# Altium schematic sheet interface.SchDoc
size A4
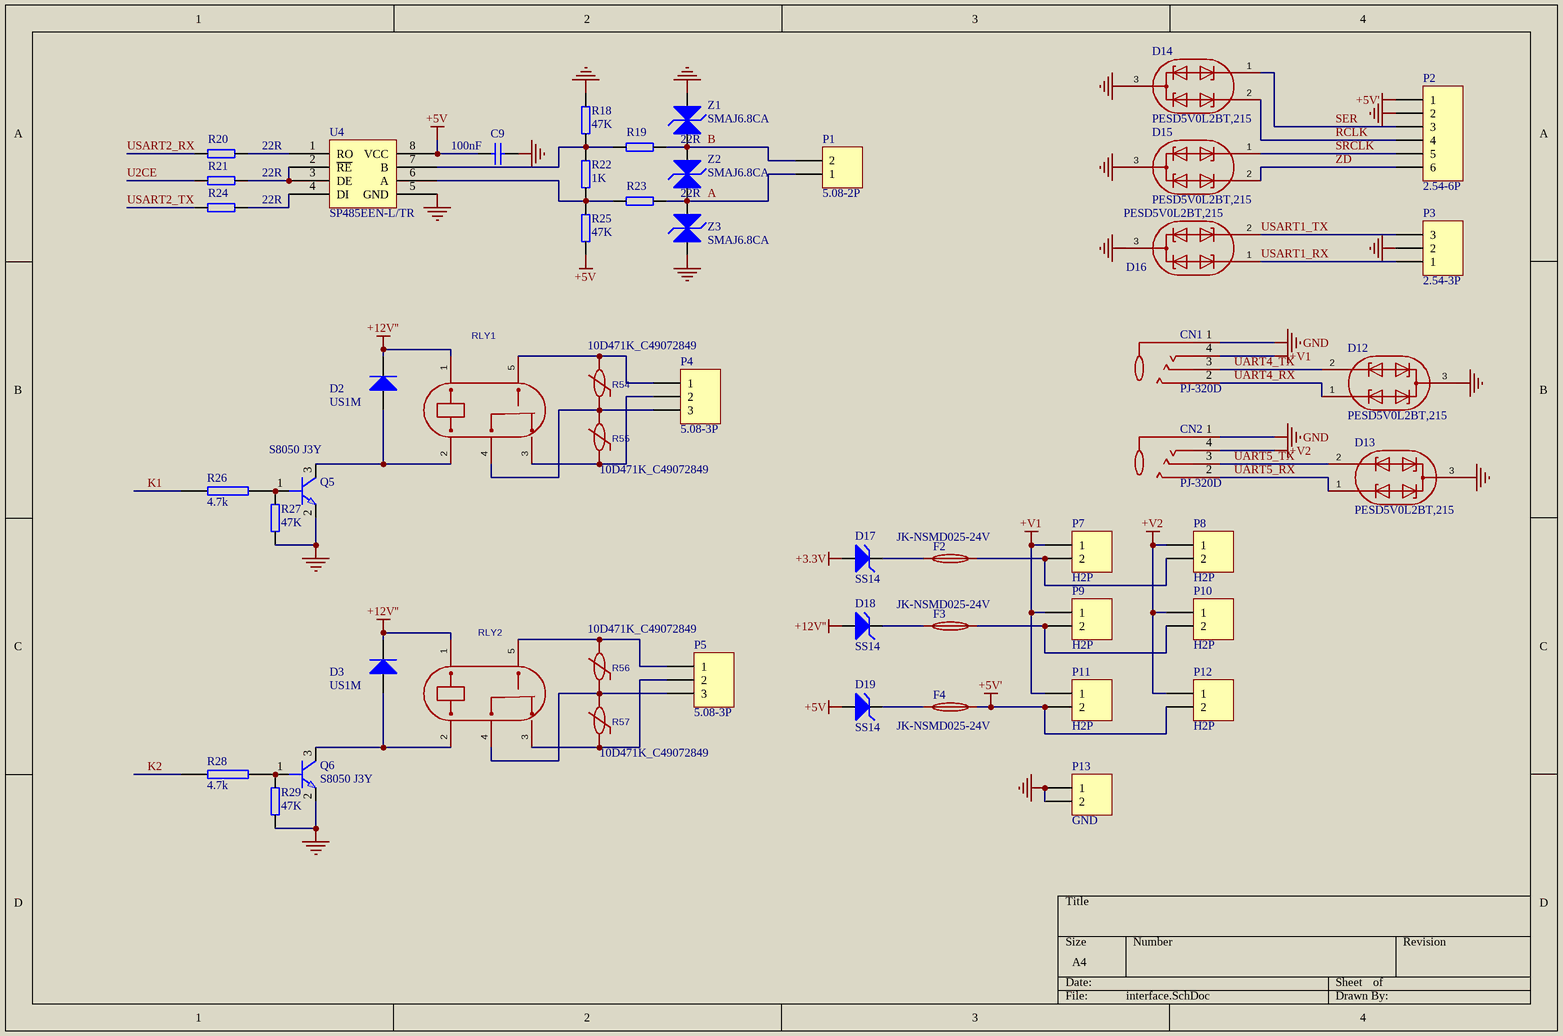
[diagram p0: interface.SchDoc]

## Parts
C9  100nF  [LC-0805_C]
CN1  PJ-320D  [4PIN]
CN2  PJ-320D  [4PIN]
D2  US1M  [LC-SMA(DO-214AC)_S2]
D3  US1M  [LC-SMA(DO-214AC)_S2]
D12  PESD5V0L2BT,215  [SOT-23]
D13  PESD5V0L2BT,215  [SOT-23]
D14  PESD5V0L2BT,215  [SOT-23]
D15  PESD5V0L2BT,215  [SOT-23]
D16  PESD5V0L2BT,215  [SOT-23]
D17  SS14  [LC-SMA(DO-214AC)_S5]
D18  SS14  [LC-SMA(DO-214AC)_S5]
D19  SS14  [LC-SMA(DO-214AC)_S5]
F2  JK-NSMD025-24V  [LC-1206_R]
F3  JK-NSMD025-24V  [LC-1206_R]
F4  JK-NSMD025-24V  [LC-1206_R]
P1  5.08-2P  [MKDSN_2RMI]
P2  2.54-6P  [6PIN]
P3  2.54-3P  [3PIN]
P4  5.08-3P  [5.08-3P]
P5  5.08-3P  [5.08-3P]
P7  H2P  [HDR1X2]
P8  H2P  [HDR1X2]
P9  H2P  [HDR1X2]
P10  H2P  [HDR1X2]
P11  H2P  [HDR1X2]
P12  H2P  [HDR1X2]
P13  GND  [HDR1X2]
Q5  S8050 J3Y  [SOT-23]
Q6  S8050 J3Y  [SOT-23]
R18  47K  [LC-0805_R]
R19  22R  [LC-0805_R]
R20  22R  [LC-0805_R]
R21  22R  [LC-0805_R]
R22  1K  [LC-0805_R]
R23  22R  [LC-0805_R]
R24  22R  [LC-0805_R]
R25  47K  [LC-0805_R]
R26  4.7k  [LC-0805_R]
R27  47K  [LC-0805_R]
R28  4.7k  [LC-0805_R]
R29  47K  [LC-0805_R]
R54  10D471K_C49072849  [RES-TH_L11.0-W6.0-P7.50]
R55  10D471K_C49072849  [RES-TH_L11.0-W6.0-P7.50]
R56  10D471K_C49072849  [RES-TH_L11.0-W6.0-P7.50]
R57  10D471K_C49072849  [RES-TH_L11.0-W6.0-P7.50]
RLY1  JQC-3FF/12VDC-1ZS(551)  (value not drawn)
RLY2  JQC-3FF/12VDC-1ZS(551)  (value not drawn)
U4  SP485EEN-L/TR  [LC-SOIC-8_150mil]
Z1  SMAJ6.8CA  [1812]
Z2  SMAJ6.8CA  [1812]
Z3  SMAJ6.8CA  [1812]

## Nets
+3.3V: D17.1(A)
+5V: C9.2 D19.1(A) R25.1 U4.8(VCC)
+5V': F4.2 P2.1 P11.2 P12.2
+12V'': D2.2(K) D3.2(K) D18.1(A) RLY1.1 RLY2.1
+V1: CN1.4 P7.1 P9.1 P11.1
+V2: CN2.4 P8.1 P10.1 P12.1
GND: C9.1 CN1.1 CN2.1 D12.3(DC) D13.3(DC) D14.3(DC) D15.3(DC) D16.3(DC) P2.2 P3.2 P13.1 P13.2 Q5.2(E) Q6.2(E) R18.2 R27.1 R29.1 U4.5(GND) Z1.1 Z3.2
A: P1.1 R23.2 Z2.2 Z3.1
B: P1.2 R19.2 Z1.2 Z2.1
K1: R26.1
K2: R28.1
RCLK: D14.2(C2) P2.4
SER: D14.1(C1) P2.3
SRCLK: D15.1(C1) P2.5
U2CE: R21.1
UART4_RX: CN1.2 D12.1(C1)
UART4_TX: CN1.3 D12.2(C2)
UART5_RX: CN2.2 D13.1(C1)
UART5_TX: CN2.3 D13.2(C2)
USART1_RX: D16.1(C1) P3.1
USART1_TX: D16.2(C2) P3.3
USART2_RX: R20.1
USART2_TX: R24.1
ZD: D15.2(C2) P2.6
NetD2_1: D2.1(A) Q5.3(C) RLY1.2
NetD3_1: D3.1(A) Q6.3(C) RLY2.2
NetD17_2: D17.2(K) F2.1
NetD18_2: D18.2(K) F3.1
NetD19_2: D19.2(K) F4.1
NetF2_2: F2.2 P7.2 P8.2
NetF3_2: F3.2 P9.2 P10.2
NetP4_1: P4.1 R54.2 RLY1.5
NetP4_2: P4.2 R55.1 RLY1.3
NetP4_3: P4.3 R54.1 R55.2 RLY1.4
NetP5_1: P5.1 R56.2 RLY2.5
NetP5_2: P5.2 R57.1 RLY2.3
NetP5_3: P5.3 R56.1 R57.2 RLY2.4
NetQ5_1: Q5.1(B) R26.2 R27.2
NetQ6_1: Q6.1(B) R28.2 R29.2
NetR18_1: R18.1 R19.1 R22.2 U4.7(B)
NetR20_2: R20.2 U4.1(RO)
NetR21_2: R21.2 U4.2(~{RE}) U4.3(DE)
NetR22_1: R22.1 R23.1 R25.2 U4.6(A)
NetR24_2: R24.2 U4.4(DI)

## Library data of the parts
C9 = CAP: Capacitor; Published: 8-Jun-2000; Revision: July-2002: Re-released for DXP Platform.; Publisher: Altium Limited; Value: 100nF
CN1 CN2 = PJ-320D_C431535: Manufacturer: SHOU HAN(首韩); Add into BOM: yes; Connector Type: 3.5mm耳机座; Current Rating (Max): 500mA; Voltage Rating (Max): 50V; Symbol: PJ-320D; Device: PJ-320D_C431535; LCSC Part Name: 3.5mm耳机座; Supplier Part: C431535; Manufacturer Part: PJ-320D; Supplier Footprint: SMD; JLCPCB Part Class: Extended Part; Datasheet: https://atta.szlcsc.com/upload/public/pdf/source/20190925/C431535_8B274506621F6117FB020BF07A197848.pdf; Supplier: LCSC; Convert to PCB: yes; Contact Material: 铜; Contact Plating: 银; Operating Temperature Range: -30℃~+70℃
D2 D3 = Diode: Default Diode; Published: 8-Jun-2000; LatestRevisionDate: 17-Jul-2002; LatestRevisionNote: Re-released for DXP Platform.; PackageVersion: Sep-1996; PackageReference: SMC; Publisher: Altium Limited; PackageDescription: DO-214-AB/SMC; 2 C-Bend Leads; Body 7.9 x 5.9 mm, inc. leads (LxW); Code_JEDEC: DO-214-AB
D17-D19 = CONSTANT: constant diode
F2-F4 = JK-MSMD110-24V: Manufacturer: JK(金科); Add into BOM: yes; Voltage - Max: 24V; Current - Max: 100A; Hold Current: 1.1A; Trip Current: 2.2A; Resistance - Initial (Ri) (Min): 50mΩ; Resistance - Post Trip (R1) (Max): 250mΩ; Time to Trip(Max): 300ms; Symbol: JK-MSMD110-24V; Device: JK-MSMD110-24V; LCSC Part Name: 24V 1.1A 1812自恢复; Supplier Part: C369172; Manufacturer Part: JK-MSMD110-24V; Supplier Footprint: 1812; JLCPCB Part Class: 扩展库; Datasheet: https://item.szlcsc.com/datasheet/JK-MSMD110-24V/343085.html; Supplier: LCSC; Convert to PCB: yes; Operating Temperature: -40℃~+85℃; Length: 4.73mm; Width: 3.41mm; Height: 1.3mm; Pitch: -
P1 P7-P13 = Header 2: Header, 2-Pin; LatestRevisionDate: 17-Jul-2002; LatestRevisionNote: Re-released for DXP Platform.; Publisher: Altium Limited
P2 = Header 6: Header, 6-Pin; LatestRevisionDate: 17-Jul-2002; LatestRevisionNote: Re-released for DXP Platform.; Publisher: Altium Limited
P3-P5 = Header 3: Header, 3-Pin; LatestRevisionDate: 17-Jul-2002; LatestRevisionNote: Re-released for DXP Platform.; Publisher: Altium Limited
Q5 Q6 = 2N5551: Text Field1: 20; Text Field2: 20
R18 R20 R21 R23-R25 R27 R29 = RES22: 1K
R19 R22 = RES22
R26 R28 = RES2
R54-R57 = 14D471K_C49069733: Symbol: 14D471K_C49069733
U4 = MAX483: *
Z1-Z3 = BANQIAO: DIODE BRIDGE
D12-D16 = PESD5V0L2BT,215: Symbol: PESD5V0L2BT,215
RLY1 RLY2 = JQC-3FF/12VDC-1ZS(551): Symbol: JQC-3FF/12VDC-1ZS(551)